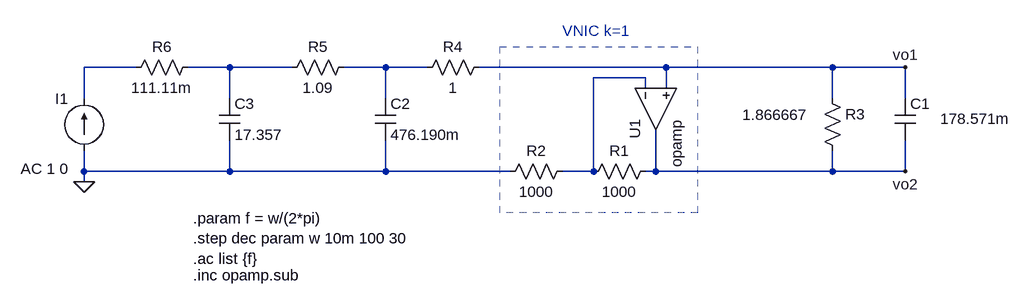
[diagram p0: schematic circuito.asc]
circuito.asc, the LTspice schematic file:
Version 4
SHEET 1 880 680
WIRE -592 64 -672 64
WIRE -448 64 -512 64
WIRE -352 64 -448 64
WIRE -208 64 -272 64
WIRE -144 64 -208 64
WIRE 224 64 -64 64
WIRE 480 64 224 64
WIRE 592 64 480 64
WIRE 192 80 112 80
WIRE 192 96 192 80
WIRE 224 96 224 64
WIRE -672 112 -672 64
WIRE -448 112 -448 64
WIRE -208 112 -208 64
WIRE 480 112 480 64
WIRE 592 112 592 64
WIRE -672 224 -672 192
WIRE -448 224 -448 176
WIRE -448 224 -672 224
WIRE -208 224 -208 176
WIRE -208 224 -448 224
WIRE -16 224 -208 224
WIRE 112 224 112 80
WIRE 112 224 64 224
WIRE 208 224 208 160
WIRE 208 224 192 224
WIRE 480 224 480 192
WIRE 480 224 208 224
WIRE 592 224 592 176
WIRE 592 224 480 224
WIRE -672 240 -672 224
FLAG -672 240 0
FLAG 592 64 vo1
FLAG 592 224 vo2
SYMBOL OpAmps\\opamp 144 128 M90
SYMATTR InstName U1
SYMBOL res 208 208 R90
WINDOW 0 0 56 VBottom 2
WINDOW 3 32 56 VTop 2
SYMATTR InstName R1
SYMATTR Value 1000
SYMBOL res 80 208 R90
WINDOW 0 0 56 VBottom 2
WINDOW 3 32 56 VTop 2
SYMATTR InstName R2
SYMATTR Value 1000
SYMBOL res 464 96 R0
WINDOW 3 -123 41 Left 2
SYMATTR Value 1.866667
SYMATTR InstName R3
SYMBOL cap 576 112 R0
WINDOW 3 70 31 Left 2
SYMATTR Value 178.571m
SYMATTR InstName C1
SYMBOL res -48 48 R90
WINDOW 0 0 56 VBottom 2
WINDOW 3 32 56 VTop 2
SYMATTR InstName R4
SYMATTR Value 1
SYMBOL cap -224 112 R0
SYMATTR InstName C2
SYMATTR Value 476.190m
SYMBOL res -256 48 R90
WINDOW 0 0 56 VBottom 2
WINDOW 3 32 56 VTop 2
SYMATTR InstName R5
SYMATTR Value 1.09
SYMBOL cap -464 112 R0
SYMATTR InstName C3
SYMATTR Value 17.357
SYMBOL res -496 48 R90
WINDOW 0 0 56 VBottom 2
WINDOW 3 32 56 VTop 2
SYMATTR InstName R6
SYMATTR Value 111.11m
SYMBOL current -672 192 R180
WINDOW 0 24 80 Left 2
WINDOW 3 24 0 Left 2
WINDOW 123 24 -28 Left 2
WINDOW 39 0 0 Left 0
SYMATTR InstName I1
SYMATTR Value ""
SYMATTR Value2 AC 1 0
TEXT -504 384 Left 2 !.inc opamp.sub
TEXT -504 296 Left 2 !.param f = w/(2*pi)\n.step dec param w 10m 100 30\n.ac list {f}
TEXT 64 8 Left 2 ;VNIC k=1
RECTANGLE Normal 272 288 -32 32 2

The netlist it stands for:
* circuito.asc
XU1 N004 vo1 vo2 opamp Aol=100K GBW=10Meg  ; pins invin noninvin out
R1 vo2 N004 1000
R2 N004 0 1000
R3 vo1 vo2 1.866667
C1 vo1 vo2 178.571m
R4 vo1 N003 1
C2 N003 0 476.190m
R5 N003 N002 1.09
C3 N002 0 17.357
R6 N002 N001 111.11m
I1 0 N001 AC 1 0
.inc opamp.sub
.param f = w/(2*pi)
.step dec param w 10m 100 30
.ac list {f}
* VNIC k=1
.backanno
.end